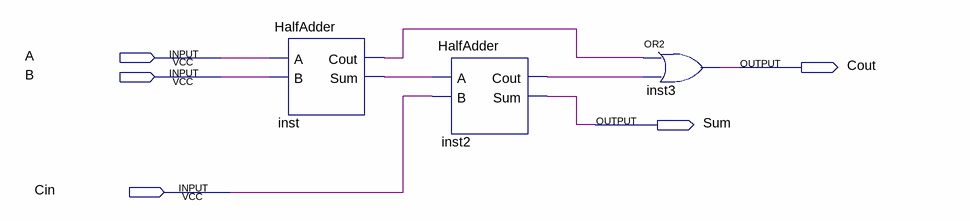
[diagram p0: schematic sheet]
// Quartus schematic FullAdder.bdf as structural Verilog: 3 symbols, 5 pins
module FullAdder (
  input  A,
  input  B,
  input  Cin,
  output Cout,
  output Sum
);

  wire inst2_cout, inst_cout, inst_sum;

  HalfAdder inst (.A(A), .B(B), .Cout(inst_cout), .Sum(inst_sum));
  HalfAdder inst2 (.A(inst_sum), .B(Cin), .Cout(inst2_cout), .Sum(Sum));
  or inst3 (Cout, inst_cout, inst2_cout);
endmodule
